# Altium schematic sheet BrauV2_Power.SchDoc
size 420 x 297 mm; PageSetup: Record=PageOptions|CenterHorizontal=True|CenterVertical=True|PrintScale=1.01|XCorrection=1.00|YCorrection=1.00|PrintKind=1|BorderSize=5000000|LeftOffset=0|BottomOffset=0|Orientation=2|PaperLength=1000|PaperWidth=1000|Scale=100|PaperSource=7|PrintQuality=-4|MediaType=1|DitherType=10|PaperKind=A3|PrintScaleMode=1; DocumentNumber: 3; SheetNumber: 3; SheetTotal: 22
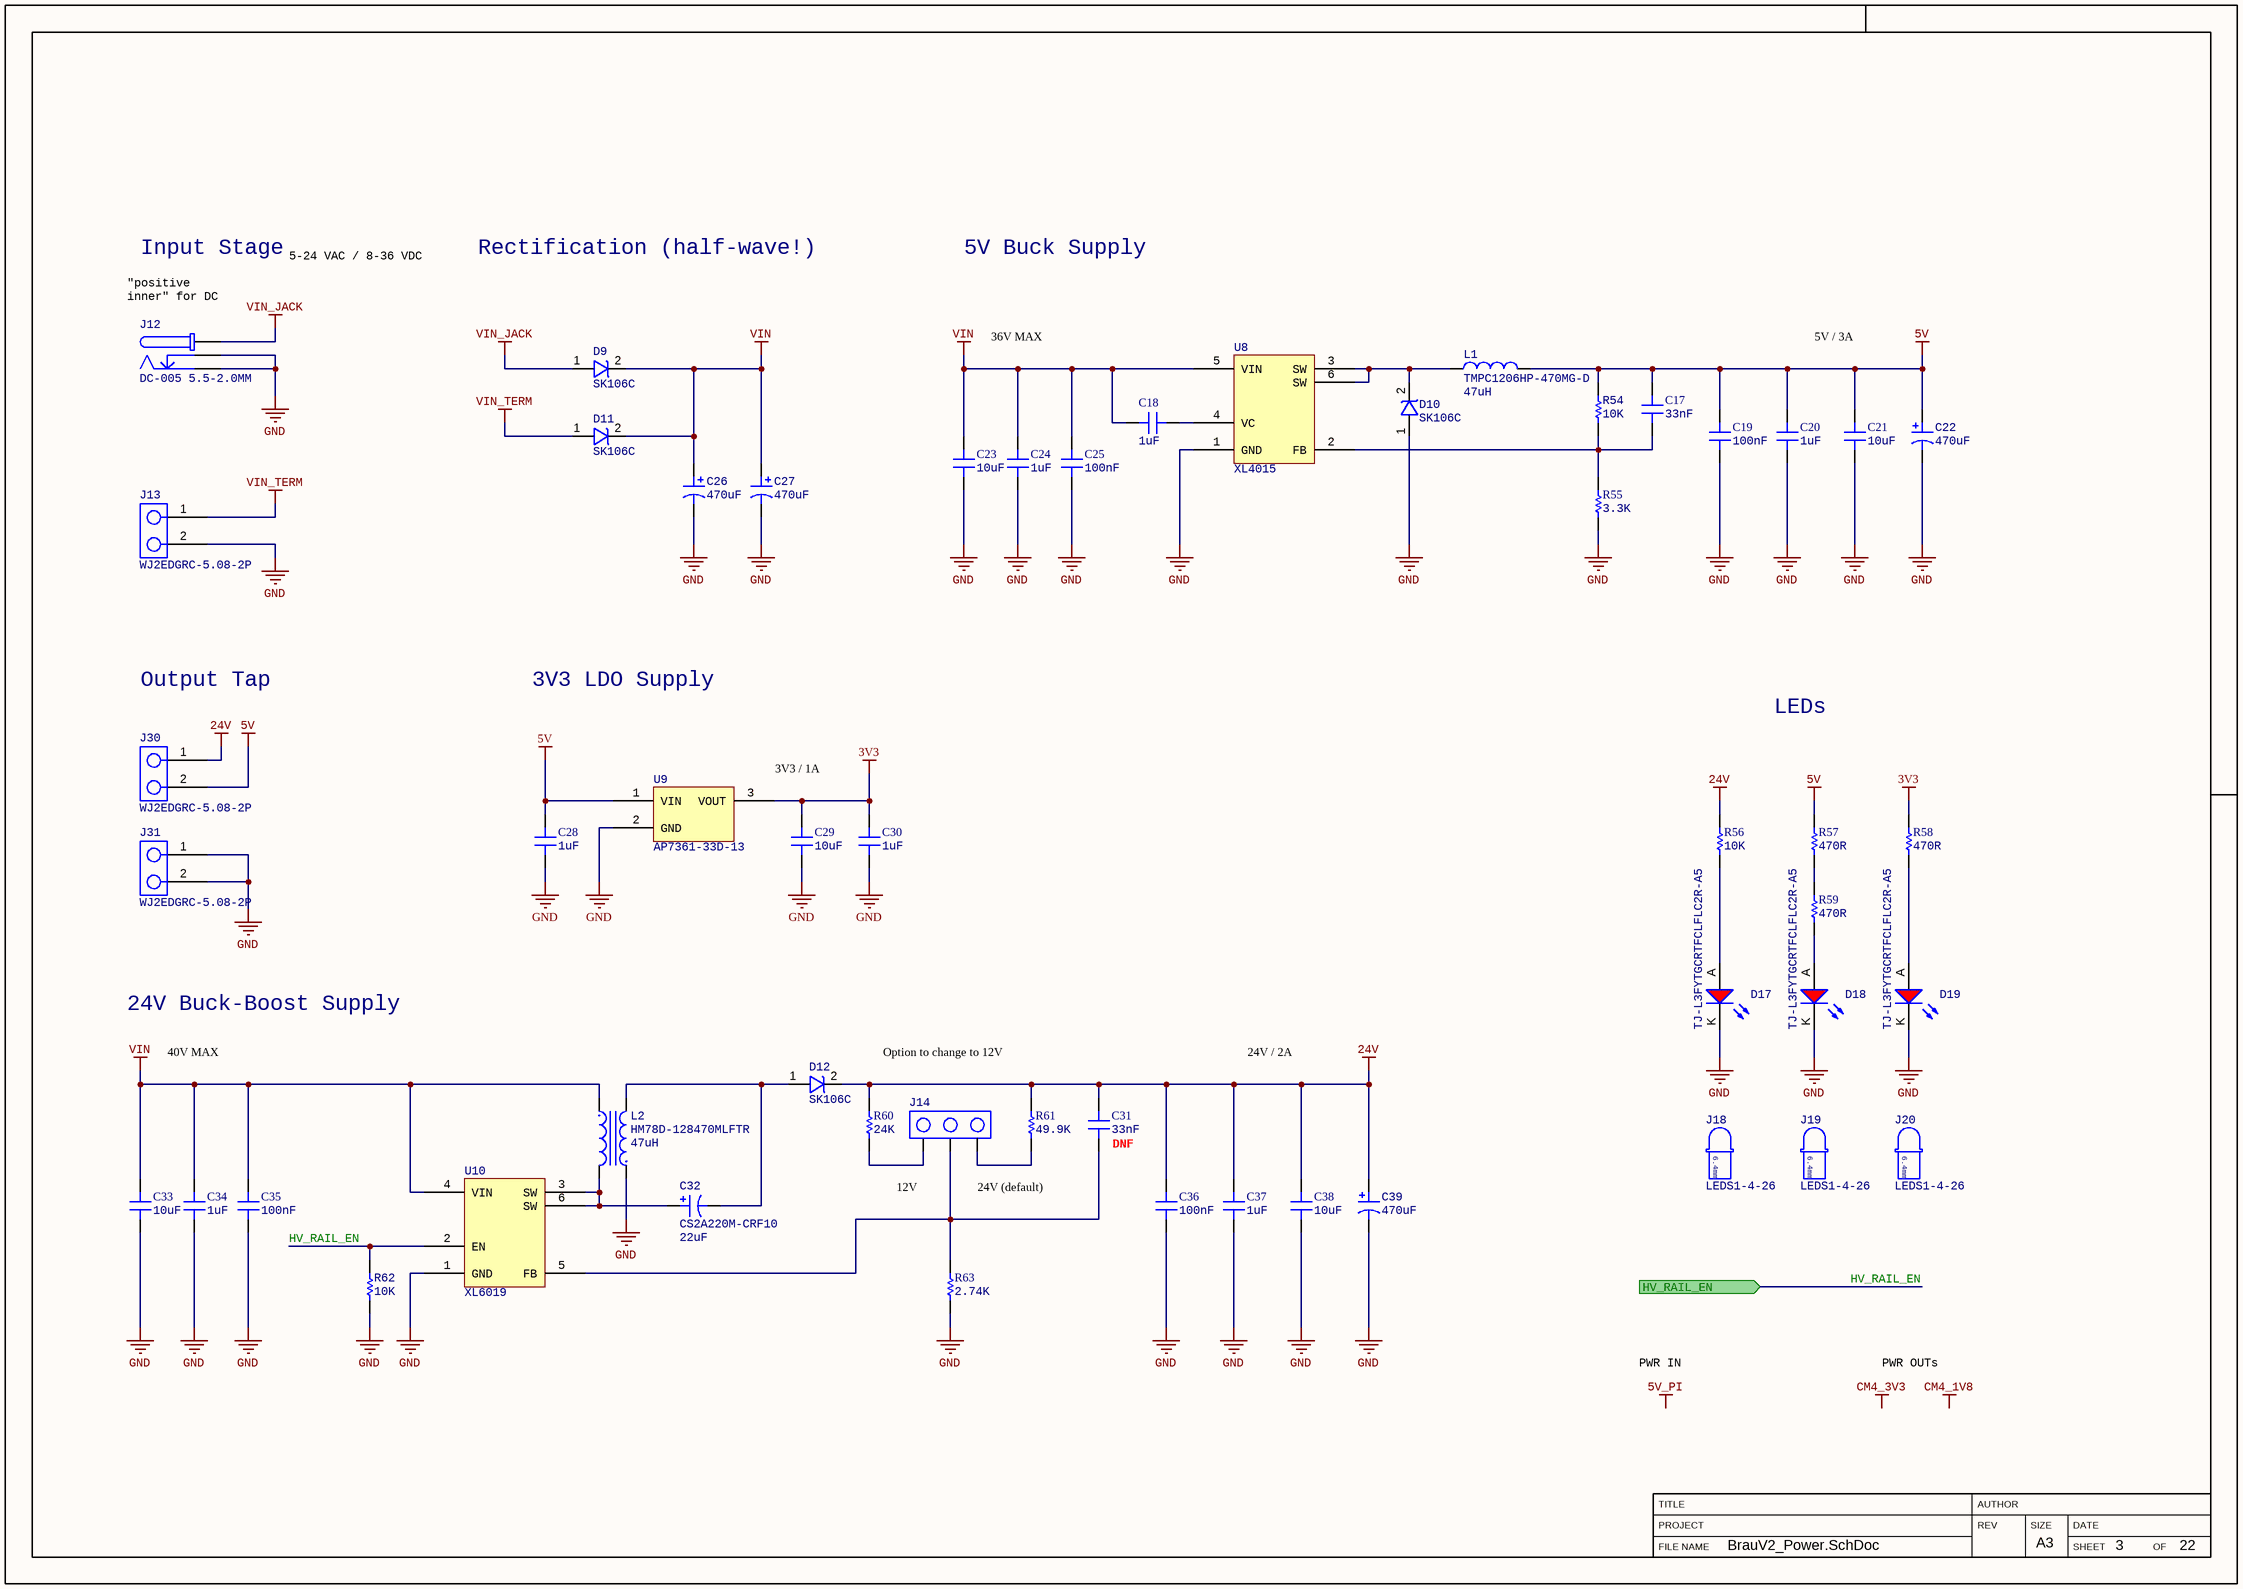
[diagram p0: BrauV2_Power.SchDoc]

## Parts
C17  Capacitance: 33nF  [SMD_CAP_0402(1005)_N]  (hidden comment: CC0402KRX7R9BB333)
C18  Capacitance: 1uF  [SMD_CAP_0603(0201)_N]  (hidden comment: CC0603KRX5R9BB105)
C19  Capacitance: 100nF  [SMD_CAP_0402(1005)_N]  (hidden comment: CC0402KRX5R9BB104)
C20  Capacitance: 1uF  [SMD_CAP_0603(0201)_N]  (hidden comment: CC0603KRX5R9BB105)
C21  Capacitance: 10uF  [SMD_CAP_1206(3216)_N]  (hidden comment: CC1206KKX5R9BB106)
C22  Capacitance: 470uF  [CAP_SMD_10x10.5mm]  (hidden comment: CK1V471MCRG10)
C23  Capacitance: 10uF  [SMD_CAP_1206(3216)_N]  (hidden comment: CC1206KKX5R9BB106)
C24  Capacitance: 1uF  [SMD_CAP_0603(0201)_N]  (hidden comment: CC0603KRX5R9BB105)
C25  Capacitance: 100nF  [SMD_CAP_0402(1005)_N]  (hidden comment: CC0402KRX5R9BB104)
C26  Capacitance: 470uF  [CAP_SMD_10x10.5mm]  (hidden comment: CK1V471MCRG10)
C27  Capacitance: 470uF  [CAP_SMD_10x10.5mm]  (hidden comment: CK1V471MCRG10)
C28  Capacitance: 1uF  [SMD_CAP_0603(0201)_N]  (hidden comment: CC0603KRX5R9BB105)
C29  Capacitance: 10uF  [SMD_CAP_1206(3216)_N]  (hidden comment: CC1206KKX5R9BB106)
C30  Capacitance: 1uF  [SMD_CAP_0603(0201)_N]  (hidden comment: CC0603KRX5R9BB105)
C31  Capacitance: 33nF  [SMD_CAP_0402(1005)_N]  (hidden comment: CC0402KRX7R9BB333)
C32  CS2A220M-CRF10  Capacitance: 22uF  [CAP_SMD_8x10.5mm]
C33  Capacitance: 10uF  [SMD_CAP_1206(3216)_N]  (hidden comment: CC1206KKX5R9BB106)
C34  Capacitance: 1uF  [SMD_CAP_0603(0201)_N]  (hidden comment: CC0603KRX5R9BB105)
C35  Capacitance: 100nF  [SMD_CAP_0402(1005)_N]  (hidden comment: CC0402KRX5R9BB104)
C36  Capacitance: 100nF  [SMD_CAP_0402(1005)_N]  (hidden comment: CC0402KRX5R9BB104)
C37  Capacitance: 1uF  [SMD_CAP_0603(0201)_N]  (hidden comment: CC0603KRX5R9BB105)
C38  Capacitance: 10uF  [SMD_CAP_1206(3216)_N]  (hidden comment: CC1206KKX5R9BB106)
C39  Capacitance: 470uF  [CAP_SMD_10x10.5mm]  (hidden comment: CK1V471MCRG10)
D9  SK106C  [DO-214AB]
D10  SK106C  [DO-214AB]
D11  SK106C  [DO-214AB]
D12  SK106C  [DO-214AB]
D17  TJ-L3FYTGCRTFCLFLC2R-A5  [LED_3MM_SPACED_6.4MM_RED]
D18  TJ-L3FYTGCRTFCLFLC2R-A5  [LED_3MM_SPACED_6.4MM_RED]
D19  TJ-L3FYTGCRTFCLFLC2R-A5  [LED_3MM_SPACED_6.4MM_RED]
J12  DC-005 5.5-2.0MM  [DC-005 5.5-2.0MM]
J13  WJ2EDGRC-5.08-2P  [796638-2]
J14  12251103CNG0S115001  [Header_3POS]  (value not drawn)
J18  LEDS1-4-26  [3MM_LED_SPACER_6.4MM]
J19  LEDS1-4-26  [3MM_LED_SPACER_6.4MM]
J20  LEDS1-4-26  [3MM_LED_SPACER_6.4MM]
J30  WJ2EDGRC-5.08-2P  [796638-2]
J31  WJ2EDGRC-5.08-2P  [796638-2]
L1  TMPC1206HP-470MG-D  Inductance: 47uH  [TMPC1206HP-470MG-D]
L2  HM78D-128470MLFTR  Parallel Inductance: 47uH  [HM78D-128470MLFTR]
R54  Resistance: 10K  [SMD_RES_0402(1005)_N]  (hidden comment: RC0402FR-0710KL)
R55  Resistance: 3.3K  [SMD_RES_0402(1005)_N]  (hidden comment: RC0402FR-073K3L)
R56  Resistance: 10K  [SMD_RES_0402(1005)_N]  (hidden comment: RC0402FR-0710KL)
R57  Resistance: 470R  [SMD_RES_0402(1005)_N]  (hidden comment: RC0402FR-07470RL)
R58  Resistance: 470R  [SMD_RES_0402(1005)_N]  (hidden comment: RC0402FR-07470RL)
R59  Resistance: 470R  [SMD_RES_0402(1005)_N]  (hidden comment: RC0402FR-07470RL)
R60  Resistance: 24K  [SMD_RES_0402(1005)_N]  (hidden comment: RC0402FR-0724KL)
R61  Resistance: 49.9K  [SMD_RES_0402(1005)_N]  (hidden comment: RC0402FR-0749K9L)
R62  Resistance: 10K  [SMD_RES_0402(1005)_N]  (hidden comment: RC0402FR-0710KL)
R63  Resistance: 2.74K  [SMD_RES_0402(1005)_N]  (hidden comment: RC0402FR-072K74L)
U8  XL4015  [TO-263-5]
U9  AP7361-33D-13  [TO-252]
U10  XL6019  [TO-263-5]

## Ports
HV_RAIL_EN (in)

## Nets
3V3: C29.2 C30.2 R58.2 U9.3(VOUT)
5V: C17.2 C19.2 C20.2 C21.2 C22.1 C28.2 J30.2 L1.2 R54.2 R57.2 U9.1(VIN)
24V: C31.2 C36.2 C37.2 C38.2 C39.1 D12.2(CATHODE) J30.1 R56.2 R60.2 R61.2
GND: C19.1 C20.1 C21.1 C22.2 C23.1 C24.1 C25.1 C26.2 C27.2 C28.1 C29.1 C30.1 C33.1 C34.1 C35.1 C36.1 C37.1 C38.1 C39.2 D10.1(ANODE) D17.K D18.K D19.K J12.2 J12.3 J13.2 J31.1 J31.2 L2.1 R55.1 R62.1 R63.1 U8.1(GND) U9.2(GND) U10.1(GND)
VIN: C18.2 C23.2 C24.2 C25.2 C26.1 C27.1 C33.2 C34.2 C35.2 D9.2(CATHODE) D11.2(CATHODE) L2.2 U8.5(VIN) U10.4(VIN)
VIN_JACK: D9.1(ANODE) J12.4
VIN_TERM: D11.1(ANODE) J13.1
HV_RAIL_EN: R62.2 U10.2(EN) ; port HV_RAIL_EN
NetC17_1: C17.1 R54.1 R55.2 U8.2(FB)
NetC18_1: C18.1 U8.4(VC)
NetC31_1: C31.1 J14.2 R63.2 U10.5(FB)
NetC32_1: C32.1 L2.4 U10.3(SW) U10.6(SW)
NetC32_2: C32.2 D12.1(ANODE) L2.3
NetD10_2: D10.2(CATHODE) L1.1 U8.3(SW) U8.6(SW)
NetD17_A: D17.A R56.1
NetD18_A: D18.A R59.1
NetD19_A: D19.A R58.1
NetJ14_1: J14.1 R60.1
NetJ14_3: J14.3 R61.1
NetR57_1: R57.1 R59.2

## Notes on the sheet
- Input Stage
- 5-24 VAC / 8-36 VDC
- Rectification (half-wave!)
- 5V Buck Supply
- (near J12) "positive inner" for DC Supplies
- 36V MAX
- 5V / 3A
- Output Tap
- 3V3 LDO Supply
- LEDs
- 3V3 / 1A
- 24V Buck-Boost Supply
- 40V MAX
- Option to change to 12V
- 24V / 2A
- 12V
- 24V (default)
- (near C31) DNF
- PWR IN
- PWR OUTs
- Labels drawn without touching a wire or pin: 5V_PI, CM4_1V8, CM4_3V3
- FILE NAME
- PROJECT
- TITLE
- REV
- AUTHOR
- SIZE
- SHEET
- DATE
- OF
- A3
- (in symbol LEDS1-4-26) 6.4mm

## Library data of the parts
C17 C31 = 33nF 0402 50V 10%: 33nF ±10% 50V X7R 0402 Multilayer Ceramic Capacitors MLCC - SMD/SMT RoHS; Package: 0402; Tolerance: 10%; Voltage Rating: 50V
C18 C20 C24 C28 C30 C34 C37 = 1uF 0603 50V 10%: 1uF ±10% 50V X5R 0603 Multilayer Ceramic Capacitors MLCC - SMD/SMT RoHS; Package: 0603; Tolerance: 10%; Voltage Rating: 50V
C19 C25 C35 C36 = 100nF 0402 50V 10%: 100nF ±10% 50V X5R 0402 Multilayer Ceramic Capacitors MLCC - SMD/SMT RoHS; Package: 0402; Tolerance: 10%; Voltage Rating: 50V
C21 C23 C29 C33 C38 = 10uF 1206 50V 10%: 10uF ±10% 50V X5R 1206 Multilayer Ceramic Capacitors MLCC - SMD/SMT RoHS; Package: 1206; Tolerance: 10%; Voltage Rating: 50V
C22 C26 C27 C39 = CK1V471MCRG10: 470uF ±20% 35V SMD,10x10.5mm Aluminum Electrolytic Capacitors - SMD RoHS; Voltage Max: 35V; Tolerance: 20%
C32 = CS2A220M-CRF10: 22uF ±20% 100V SMD,8x10.5mm Aluminum Electrolytic Capacitors - SMD RoHS; Voltage Max: 100V; Tolerance: 20%
D9-D12 = SK106C: 60V 10A 850mV @ 10A SMC(DO-214AB) Schottky Barrier Diodes (SBD) RoHS
D17-D19 = TJ-L3FYTGCRTFCLFLC2R-A5: LED 3mm Red 620nm~630nm 1.8V~2.6V Through Hole Light Emitting Diodes (LED) RoHS C331031
J12 = DC-005 5.5-2.0MM: Through Hole AC/DC Power Plugs & Receptacles RoHS
J13 J30 J31 = WJ2EDGRC-5.08-2P: Covered（4Sided） 2 1 0.200"（5.08mm） 2 P=5.08mm Pluggable System Terminal Block RoHS
J14 = 3-way Jumper: Pin Header 3 1 right-angle，180degrees 2.54mm Through Hole,P=2.54mm Pin Header & Female Header RoHS
J18-J20 = LEDS1-4-26: 3mm LED spacer 6.4mm height
L1 = TMPC1206HP-470MG-D: 47uH ±20% 5.5A 80mΩ SMD,13.5x12.5x5.7mm Power Inductors RoHS; Saturation Current: 7A; DC Resistance: 80mR; Current Max: 5.5A; Size: 13.5x12.5x5.7mm
L2 = HM78D-128470MLFTR: Coupled Inductors 47uH 20%; Current Max: 5.2A; DC Resistance: 90mR; Size: 12.5x12.5x8.05mm
R54 R56 R62 = 10K 0402 1% 1/16W: 10kΩ ±1% 1/16W ±100ppm/℃ 0402 Chip Resistor - Surface Mount RoHS; Package: 0402; Tolerance: 1%; Power Rating: 1/16W
R55 = 3K3 0402 1% 1/16W: 3.3kΩ ±1% 1/16W ±100ppm/℃ 0402 Chip Resistor - Surface Mount RoHS; Package: 0402; Tolerance: 1%; Power Rating: 1/16W
R57-R59 = 470R 0402 1% 1W: 470Ω ±1% 1/16W ±100ppm/℃ 0402 Chip Resistor - Surface Mount RoHS; Power Rating: 1W; Package: 0402; Tolerance: 1%
R60 = 24K 0402 1% 1/16W: 24kΩ ±1% 1/16W ±100ppm/℃ 0402 Chip Resistor - Surface Mount RoHS; Package: 0402; Tolerance: 1%; Power Rating: 1/16W
R61 = 49K9 0402 1% 1/16W: 49.9kΩ ±1% 1/16W ±100ppm/℃ 0402 Chip Resistor - Surface Mount RoHS; Package: 0402; Tolerance: 1%; Power Rating: 1/16W
R63 = 2K74 0402 1% 1/16W: 2.74kΩ ±1% 1/16W ±100ppm/℃ 0402 Chip Resistor - Surface Mount RoHS; Package: 0402; Tolerance: 1%; Power Rating: 1/16W
U8 = XL4015: XLSEMI 5A 180KHz 36V Buck DC to DC Converter
U9 = AP7361-33D-13: Fixed 6V 3.3V 700mV @ 1A TO-252 Dropout Regulators(LDO) RoHS
U10 = XL6019: XLSEMI 180KHz 60V 5A Switching Current Boost / Buck-Boost / Inverting DC/DC Converter